# Altium schematic sheet 智能车.SchDoc
size A2
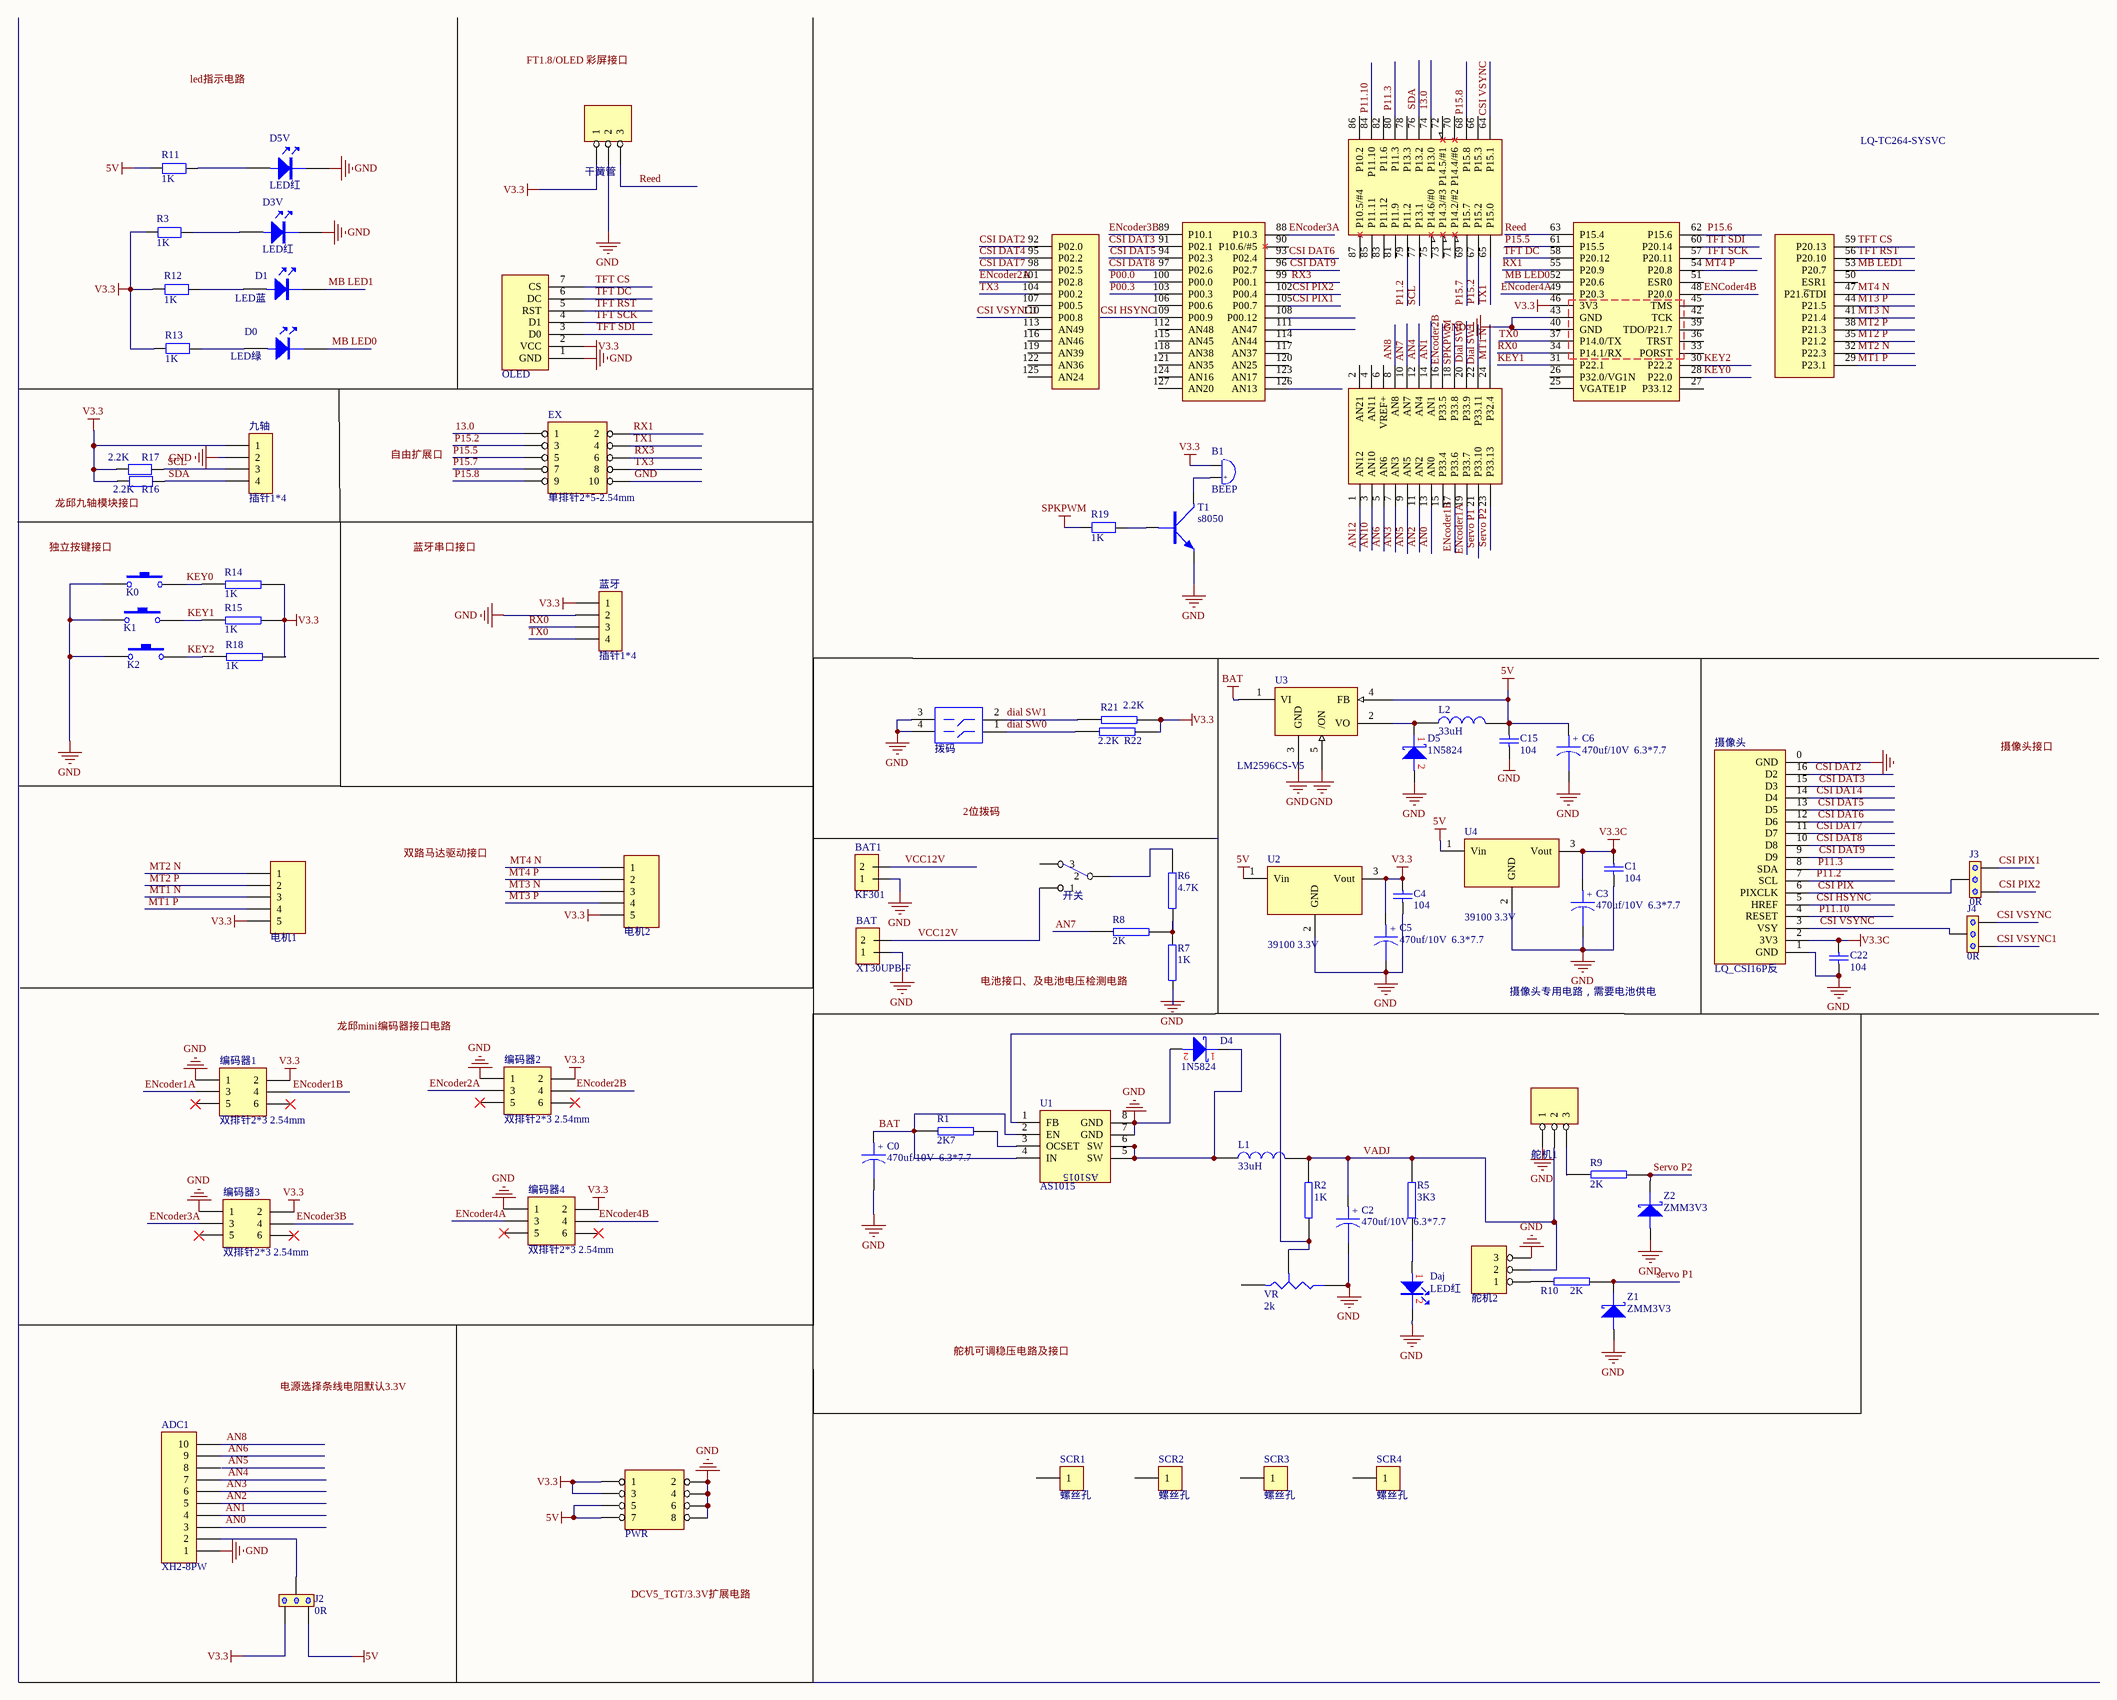
[diagram p0: 智能车.SchDoc]

## Parts
?  LQ-TC264-SYSVC  [LQ-TC264-SYSVC-S]
ADC1  XH2-8PW  [LQ_IDC5X2]
B1  BEEP  [BEEP 5x9x5.5]
BAT  XT30UPB-F  [LQ_XT30UPB-F]
BAT1  KF301  [LQ_XT30UPB-F]
C0  470uf/10V  6.3*7.7  [LQ_C6d3X7d7]
C1  104  [LQ_C0603]
C2  470uf/10V  6.3*7.7  [LQ_C6d3X7d7]
C3  470uf/10V  6.3*7.7  [TAJ-B/3528]
C4  104  [LQ_C0603]
C5  470uf/10V  6.3*7.7  [LQ_C6d3X7d7]
C6  470uf/10V  6.3*7.7  [LQ_C6d3X7d7]
C15  104  [LQ_C0603]
C22  104  [LQ_C0603]
D0  LED绿  [LQ_LED0603R]
D1  LED蓝  [LQ_LED0603R]
D3V  LED红  [LQ_LED0603R]
D4  1N5824  [LQ_D1812Z]
D5  1N5824  [LQ_D1812Z]
D5V  LED红  [LQ_LED0603R]
Daj  LED红  [LQ_led0603r]
EX  单排针2*5-2.54mm  [LQ_IDC5X2]
J2  0R  [LQ_0603JUMP]
J3  0R  [LQ_0603JUMP]
J4  0R  [LQ_0603JUMP]
K0  微动开关6*6*6  [LQ_BT4SMT]  (value not drawn)
K1  微动开关6*6*6  [LQ_BT4SMT]  (value not drawn)
K2  微动开关6*6*6  [LQ_BT4SMT]  (value not drawn)
L1  33uH  [LQ_L7X7]
L2  33uH  [LQ_L7X7]
OLED  单排座1*7-2.54  [LQ-TFT-180V33]  (value not drawn)
PWR  双排针4X2-2.54  [Pin HDR2X4/2.54mm-S]  (value not drawn)
R1  2K7  [LQ_R0603]
R2  1K  [LQ_R0603]
R3  1K  [LQ_R0603]
R5  3K3  [LQ_R0603]
R6  4.7K  [LQ_R0603]
R7  1K  [LQ_R0603]
R8  2K  [LQ_R0603]
R9  2K  [LQ_R0603]
R10  2K  [LQ_R0603]
R11  1K  [LQ_R0603]
R12  1K  [LQ_R0603]
R13  1K  [LQ_R0603]
R14  1K  [LQ_R0603]
R15  1K  [LQ_R0603]
R16  2.2K  [LQ_R0603]
R17  2.2K  [LQ_R0603]
R18  1K  [LQ_R0603]
R19  1K  [LQ_R0603]
R21  2.2K  [LQ_R0603]
R22  2.2K  [LQ_R0603]
SCR1  螺丝孔  [LQ_SCROW3&5mm]
SCR2  螺丝孔  [LQ_SCROW3&5mm]
SCR3  螺丝孔  [LQ_SCROW3&5mm]
SCR4  螺丝孔  [LQ_SCROW3&5mm]
T1  s8050  [SOT-23]
U1  AS1015  [SOP8]
U2  39100 3.3V  [SOT223_M]
U3  LM2596CS-V5  [LQ_TO-263-5]
U4  39100 3.3V  [SOT223_M]
VR  2k  [lq_3266]
Z1  ZMM3V3  [LQ_1206D]
Z2  ZMM3V3  [LQ_1206D]
九轴  插针1*4  [LQ_XH254-4P]
干簧管  XH254-3P  [LQ_XH254-3P]  (value not drawn)
开关  KCD1-101 117S  [LQ_KCD1-101 117S]  (value not drawn)
拨码  SW-DIP2  [DIP4]  (value not drawn)
摄像头  LQ_CSI16P反  [LQ_IDC8X2]
电机1  XH254-4P  [LQ_XH254-5P]  (value not drawn)
电机2  XH254-4P  [LQ_XH254-5P]  (value not drawn)
编码器1  双排针2*3 2.54mm  [LQ_ENCODER]
编码器2  双排针2*3 2.54mm  [LQ_ENCODER]
编码器3  双排针2*3 2.54mm  [LQ_ENCODER]
编码器4  双排针2*3 2.54mm  [LQ_ENCODER]
舵机1  XH254-3P  [LQ_SIP3]  (value not drawn)
舵机2  XH254-3P  [LQ_SIP3]  (value not drawn)
蓝牙  插针1*4  [LQ_SIP4]

## Nets
5V: C6.1 C15.2 J2.3 L2.2 PWR.5 PWR.7 R11.1 U2.1(Vin) U3.4(FB) U4.1(Vin)
BAT: C0.1 R1.1 U1.2(EN) U1.4(IN) U3.1(VI)
GND: ?.40(GND) ?.43(GND) ADC1.1 BAT.1 BAT1.1 C0.2 C1.1 C2.2 C3.2 C4.1 C5.2 C6.2 C15.1 C22.1 D3V.2 D4.2 D5.2 D5V.2 Daj.2 EX.10 K0.1 K1.1 K2.1 OLED.1(GND) PWR.2 PWR.4 PWR.6 PWR.8 R7.1 T1.E U1.7(GND) U1.8(GND) U2.2(GND) U3.3(GND) U3.5(/ON) U4.2(GND) VR.2(B) Z1.1 Z2.1 九轴.2 干簧管.2 拨码.3 拨码.4 摄像头.1(GND) 编码器1.1 编码器2.1 编码器3.1 编码器4.1 舵机1.1 蓝牙.2
SPKPWM: ?.18(P33.8) R19.1
V3.3: ?.46(3V3) B1.2 C4.2 C5.1 J2.1 OLED.2(VCC) PWR.1 PWR.3 R3.1 R12.1 R13.1 R14.2 R15.2 R16.1 R17.1 R18.2 R21.2 R22.2 U2.3(Vout) 九轴.1 干簧管.1 电机1.5 电机2.5 编码器1.2 编码器2.2 编码器3.2 编码器4.2 蓝牙.1
V3.3C: C1.2 C3.1 C22.2 U4.3(Vout) 摄像头.2(3V3)
13.0: ?.74(P13.0) EX.1
AN0: ?.13(AN0) ADC1.3
AN1: ?.14(AN1) ADC1.4
AN2: ?.11(AN2) ADC1.5
AN3: ?.7(AN3) ADC1.6
AN4: ?.12(AN4) ADC1.7
AN5: ?.9(AN5)
AN6: ?.5(AN6) ADC1.9
AN7: ?.10(AN7) R8.1
AN8: ?.8(AN8) ADC1.10
AN10: ?.3(AN10)
AN12: ?.1(AN12)
CSI DAT2: ?.92(P02.0) 摄像头.16(D2)
CSI DAT3: ?.91(P02.1) 摄像头.15(D3)
CSI DAT4: ?.95(P02.2) 摄像头.14(D4)
CSI DAT5: ?.94(P02.3) 摄像头.13(D5)
CSI DAT6: ?.93(P02.4) 摄像头.12(D6)
CSI DAT7: ?.98(P02.5) 摄像头.11(D7)
CSI DAT8: ?.97(P02.6) 摄像头.10(D8)
CSI DAT9: ?.96(P02.7) 摄像头.9(D9)
CSI HSYNC: ?.109(P00.9) 摄像头.5(HREF)
CSI PIX: J3.2 摄像头.6(PIXCLK)
CSI PIX1: ?.105(P00.7) J3.3
CSI PIX2: ?.102(P00.4) J3.1
CSI VSYNC: ?.64(P15.1) J4.2 J4.3 摄像头.3(VSY)
CSI VSYNC1: ?.110(P00.8) J4.1
Dial SW0: ?.20(P33.9) R22.1 拨码.1
Dial SW1: ?.22(P33.11) R21.1 拨码.2
ENcoder1A: ?.19(P33.7) 编码器1.3
ENcoder1B: ?.17(P33.6) 编码器1.4
ENcoder2A: ?.101(P02.8) 编码器2.3
ENcoder2B: ?.16(P33.5) 编码器2.4
ENcoder3A: ?.88(P10.3) 编码器3.3
ENcoder3B: ?.89(P10.1) 编码器3.4
ENcoder4A: ?.49(P20.3) 编码器4.3
ENCoder4B: ?.48(P20.0) 编码器4.4
KEY0: ?.28(P22.0) K0.2 R14.1
KEY1: ?.31(P22.1) K1.2 R15.1
KEY2: ?.30(P22.2) K2.2 R18.1
MB LED0: ?.52(P20.6) D0.2
MB LED1: ?.53(P20.7) D1.2
MT1 N: ?.24(P32.4) 电机1.3
MT1 P: ?.29(P23.1) 电机1.4
MT2 N: ?.32(P22.3) 电机1.1
MT2 P: ?.35(P21.2) ?.38(P21.3) 电机1.2
MT3 N: ?.41(P21.4) 电机2.3
MT3 P: ?.44(P21.5) 电机2.4
MT4 N: ?.47(P21.~{6}TDI) 电机2.1
MT4 P: ?.54(P20.8) 电机2.2
P00.0: ?.100(P00.0)
P00.3: ?.103(P00.3)
P11.2: ?.79(P11.2) 摄像头.7(SCL)
P11.3: ?.80(P11.3) 摄像头.8(SDA)
P11.10: ?.84(P11.10) 摄像头.4(RESET)
P15.2: ?.67(P15.2) EX.3
P15.5: ?.61(P15.5) EX.5
P15.6: ?.62(P15.6)
P15.7: ?.69(P15.7) EX.7
P15.8: ?.68(P15.8) EX.9
Reed: ?.63(P15.4) 干簧管.3
RX0: ?.34(P14.1/RX) 蓝牙.3
RX1: ?.55(P20.9) EX.2
RX3: ?.99(P00.1) EX.6
SCL: ?.77(P13.1) R17.2 九轴.3
SDA: ?.76(P13.2) R16.2 九轴.4
Servo P1: ?.21(P33.10) R10.1 Z1.2
Servo P2: ?.23(P33.13) R9.1 Z2.2
TFT CS: ?.59(P20.13) OLED.7(CS)
TFT DC: ?.58(P20.12) OLED.6(DC)
TFT RST: ?.56(P20.10) OLED.5(RST)
TFT SCK: ?.57(P20.11) OLED.4(D1)
TFT SDI: ?.60(P20.14) OLED.3(D0)
TX0: ?.37(P14.0/TX) 蓝牙.4
TX1: ?.65(P15.0) EX.4
TX3: ?.104(P00.2) EX.8
VADJ: C2.1 L1.2 R2.2 R5.2 舵机1.2 舵机2.2
VCC12V: BAT.2 BAT1.2 开关.1
NetADC1_2: ADC1.2 J2.2
NetB1_1: B1.1 T1.C
NetD0_1: D0.1 R13.2
NetD1_1: D1.1 R12.2
NetD3V_1: D3V.1 R3.2
NetD4_1: D4.1 L1.1 U1.5(SW) U1.6(SW)
NetD5_1: D5.1 L2.1 U3.2(VO)
NetD5V_1: D5V.1 R11.2
NetDaj_1: Daj.1 R5.1
NetR1_2: R1.2 U1.3(OCSET)
NetR2_1: R2.1 U1.1(FB) VR.3(TAP)
NetR6_1: R6.1 R7.2 R8.2
NetR6_2: R6.2 开关.2
NetR9_2: R9.2 舵机1.3
NetR10_2: R10.2 舵机2.1
NetR19_2: R19.2 T1.B

Not connected (* = marked no-connect by the designer): ? 2(AN21) 4(AN11) 6(VREF+) 15(P33.4) 25(VGATE1P) 26(P32.0/VG1N) 27(P33.12) 33(PORST) 36(TRST) 39(TDO/P21.7) 42(TCK) 45(TMS) 50(ESR1) 51(ESR0) 66(P15.3) 70(P14.4/#6) 71(P14.2/#2) 72(P14.5/#1) 73(P14.3/#3) 75(P14.6/#0) 78(P13.3) 81(P11.9) 82(P11.6) 83(P11.12) 85(P11.11) 86(P10.2) 87(P10.5/#4) 90(P10.6/#5) 106(P00.6) 107(P00.5) 108(P00.12) 111(AN47) 112(AN48) 113(AN49) 114(AN44) 115(AN45) 116(AN46) 117(AN37) 118(AN38) 119(AN39) 120(AN25) 121(AN35) 122(AN36) 123(AN17) 124(AN16) 125(AN24) 126(AN13) 127(AN20); ADC1 8; SCR1 1; SCR2 1; SCR3 1; SCR4 1; VR 1(A); 开关 3; 摄像头 0(GND); 编码器1 5* 6*; 编码器2 5* 6*; 编码器3 5* 6*; 编码器4 5* 6*; 舵机2 3

## Notes on the sheet
- 摄像头专用电路，需要电池供电
- Labels drawn without touching a wire or pin: 2位拨码, DCV5_TGT/3.3V扩展电路, FT1.8/OLED 彩屏接口, GND, led指示电路, 双路马达驱动接口, 摄像头接口, 独立按键接口, 电池接口、及电池电压检测电路, 电源选择条线电阻默认3.3V, 自由扩展口, 舵机可调稳压电路及接口, 蓝牙串口接口, 龙邱mini编码器接口电路, 龙邱九轴模块接口
- Title
- Size:
- Date:
- File:
- A2
- Number:
- Time:
- Revision:
- Sheet
- of
- (in symbol BEEP) +
- (in symbol CAPACITOR POL) +

## Library data of the parts
ADC1 = CON10: Connector
B1 = BEEP: 蜂鸣器
BAT BAT1 = LQ_PIN2: Jumper
C0 C2 C3 C5 C6 = CAPACITOR POL: Capacitor
C1 C4 C15 C22 = Cap: Capacitor; Published: 8-Jun-2000; LatestRevisionDate: 17-Jul-2002; LatestRevisionNote: Re-released for DXP Platform.; PackageReference: RAD-0.3; Publisher: Altium Limited; PackageDescription: Radial Cap, Thru-Hole; 2 Leads; 0.3 in Pin Spacing; Value: 104
D0 D1 D3V D5V = LED
D4 D5 = LQ_Z: Schottky Diode
Daj = LQ_LED
EX = HEADER 5X2
J2-J4 = LQ_JUMPER3: Jumper
K0-K2 = 微动开关
L1 L2 = INDUCTOR
OLED = LQ_OLED128X64
PWR = HEADER 4X2
R1 R2 R5-R10 R14 R15 R18 R21 R22 = RES2
R3 R11-R13 R16 R17 R19 = R: 贴片电阻; 版权归属: 源创客; BOM名称: 贴片电阻; 学习资源: www.ooocke.com
SCR1-SCR4 = CON1: Connector
T1 = NPN: NPN三极管
U2 U4 = VOLTREG
U3 = LM2575T
VR = RESISTOR TAPPED
Z1 Z2 = LQ_D: Schottky Diode
九轴 蓝牙 = CON4: Connector
干簧管 舵机1 舵机2 = HEADER 3
开关 = LQ_SWMTS102
电机1 电机2 = Header 5: Header, 5-Pin; LatestRevisionDate: 17-Jul-2002; LatestRevisionNote: Re-released for DXP Platform.; Publisher: Altium Limited
编码器1-编码器4 = Header 3X2: Header, 3-Pin, Dual row; LatestRevisionDate: 17-Jul-2002; LatestRevisionNote: Re-released for DXP Platform.; Publisher: Altium Limited